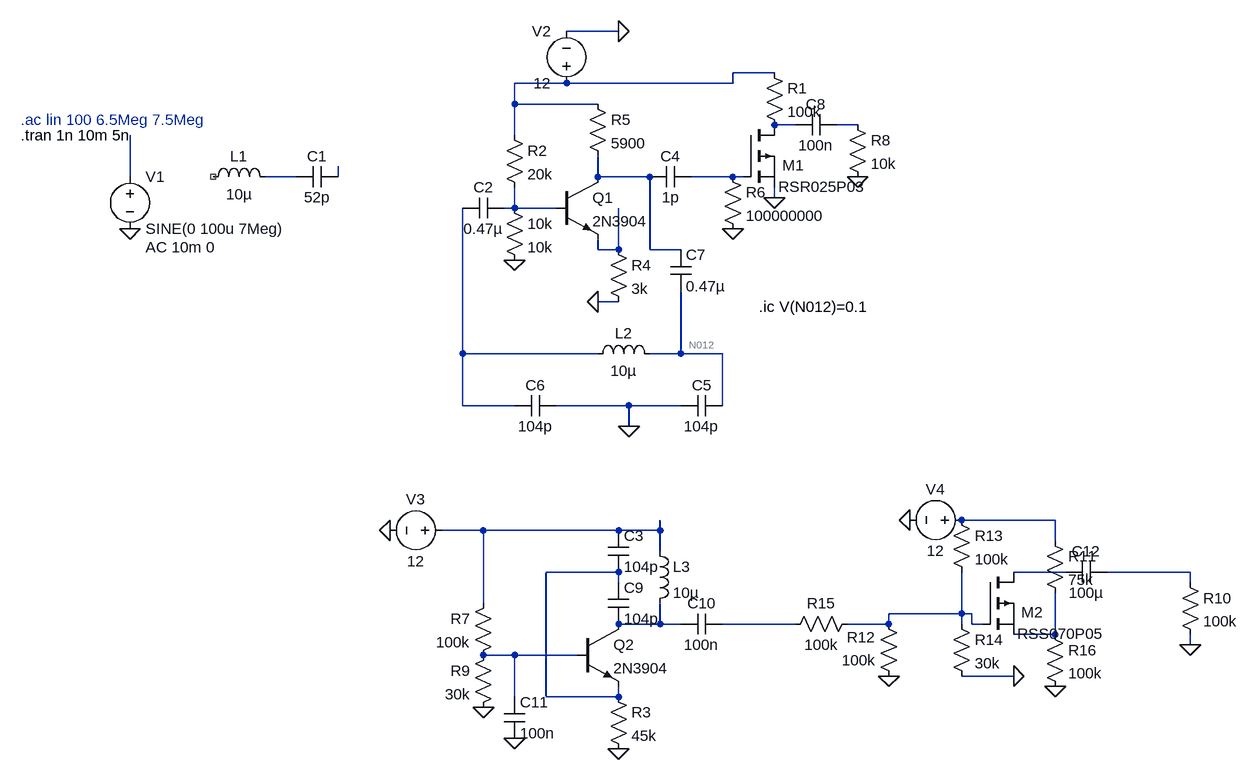
[diagram p0: schematic Colpitts.asc]
Colpitts.asc, the LTspice schematic file:
Version 4.1
SHEET 1 1552 1028
WIRE 528 -96 448 -96
WIRE 768 -32 704 -32
WIRE 448 -16 368 -16
WIRE 704 -16 704 -32
WIRE 704 -16 448 -16
WIRE 368 16 368 -16
WIRE 496 16 368 16
WIRE 800 48 768 48
WIRE 896 48 864 48
WIRE 368 64 368 16
WIRE -224 128 -224 64
WIRE 32 128 -16 128
WIRE 96 128 96 112
WIRE 496 128 496 96
WIRE 576 128 496 128
WIRE 704 128 640 128
WIRE 720 128 704 128
WIRE 768 160 768 144
WIRE 368 176 368 144
WIRE 368 176 352 176
WIRE 432 176 368 176
WIRE 496 240 496 224
WIRE 528 240 528 176
WIRE 528 240 496 240
WIRE 576 240 576 128
WIRE 624 240 576 240
WIRE 528 320 496 320
WIRE 288 400 288 176
WIRE 496 400 288 400
WIRE 624 400 624 304
WIRE 624 400 576 400
WIRE 688 400 624 400
WIRE 288 480 288 400
WIRE 368 480 288 480
WIRE 544 480 432 480
WIRE 624 480 544 480
WIRE 688 480 688 400
WIRE 544 512 544 480
WIRE 1200 656 1056 656
WIRE 320 672 256 672
WIRE 528 672 320 672
WIRE 592 672 592 656
WIRE 592 672 528 672
WIRE 1200 688 1200 656
WIRE 592 704 592 672
WIRE 528 736 416 736
WIRE 1216 736 1136 736
WIRE 1408 736 1280 736
WIRE 528 752 528 736
WIRE 1408 752 1408 736
WIRE 320 784 320 672
WIRE 1056 800 1056 736
WIRE 1056 800 944 800
WIRE 1072 800 1056 800
WIRE 592 816 592 784
WIRE 592 816 528 816
WIRE 624 816 592 816
WIRE 800 816 688 816
WIRE 944 816 944 800
WIRE 944 816 880 816
WIRE 1056 816 1056 800
WIRE 1072 816 1072 800
WIRE 1088 816 1072 816
WIRE 1200 832 1200 768
WIRE 1200 832 1136 832
WIRE 1408 848 1408 832
WIRE 368 864 320 864
WIRE 464 864 368 864
WIRE 1136 896 1056 896
WIRE 368 928 368 864
WIRE 416 928 416 736
WIRE 528 928 528 912
WIRE 528 928 416 928
FLAG -224 208 0
FLAG 368 256 0
FLAG 496 320 0
FLAG 528 -96 0
FLAG 544 512 0
FLAG 704 208 0
FLAG 896 128 0
FLAG 768 160 0
FLAG 320 944 0
FLAG 528 1008 0
FLAG 176 672 0
FLAG 368 992 0
FLAG 976 656 0
FLAG 1136 896 0
FLAG 1408 848 0
FLAG 944 896 0
FLAG 1200 912 0
SYMBOL ind -112 144 R270
WINDOW 0 32 56 VTop 2
WINDOW 3 5 56 VBottom 2
SYMATTR InstName L1
SYMATTR Value 10µ
SYMATTR SpiceLine Rser=1m
SYMBOL cap 96 112 R90
WINDOW 0 0 32 VBottom 2
WINDOW 3 32 32 VTop 2
SYMATTR InstName C1
SYMATTR Value 52p
SYMBOL voltage -224 112 R0
WINDOW 123 24 124 Left 2
WINDOW 39 0 0 Left 0
SYMATTR Value2 AC 10m 0
SYMATTR InstName V1
SYMATTR Value SINE(0 100u 7Meg)
SYMBOL npn 432 128 R0
SYMATTR InstName Q1
SYMATTR Value 2N3904
SYMBOL res 352 48 R0
SYMATTR InstName R2
SYMATTR Value 20k
SYMBOL res 352 160 R0
SYMATTR InstName 10k
SYMATTR Value 10k
SYMBOL res 480 0 R0
SYMATTR InstName R5
SYMATTR Value 5900
SYMBOL voltage 448 0 R180
WINDOW 0 24 96 Left 2
WINDOW 3 24 16 Left 2
WINDOW 123 0 0 Left 0
WINDOW 39 0 0 Left 0
SYMATTR InstName V2
SYMATTR Value 12
SYMBOL cap 352 160 R90
WINDOW 0 0 32 VBottom 2
WINDOW 3 32 32 VTop 2
SYMATTR InstName C2
SYMATTR Value 0.47µ
SYMBOL res 512 224 R0
SYMATTR InstName R4
SYMATTR Value 3k
SYMBOL ind 480 416 R270
WINDOW 0 32 56 VTop 2
WINDOW 3 5 56 VBottom 2
SYMATTR InstName L2
SYMATTR Value 10µ
SYMATTR SpiceLine Rser=1m
SYMBOL cap 688 464 R90
WINDOW 0 0 32 VBottom 2
WINDOW 3 32 32 VTop 2
SYMATTR InstName C5
SYMATTR Value 104p
SYMBOL cap 432 464 R90
WINDOW 0 0 32 VBottom 2
WINDOW 3 32 32 VTop 2
SYMATTR InstName C6
SYMATTR Value 104p
SYMBOL pmos 720 48 R0
WINDOW 0 60 62 Left 2
WINDOW 3 54 95 Left 2
SYMATTR InstName M1
SYMATTR Value RSR025P03
SYMBOL res 688 112 R0
SYMATTR InstName R6
SYMATTR Value 100000000
SYMBOL cap 608 240 R0
SYMATTR InstName C7
SYMATTR Value 0.47µ
SYMBOL cap 640 112 R90
WINDOW 0 0 32 VBottom 2
WINDOW 3 32 32 VTop 2
SYMATTR InstName C4
SYMATTR Value 1p
SYMBOL res 752 -48 R0
SYMATTR InstName R1
SYMATTR Value 100k
SYMBOL cap 864 32 R90
WINDOW 0 0 32 VBottom 2
WINDOW 3 32 32 VTop 2
SYMATTR InstName C8
SYMATTR Value 100n
SYMBOL res 880 32 R0
SYMATTR InstName R8
SYMATTR Value 10k
SYMBOL npn 464 816 R0
SYMATTR InstName Q2
SYMATTR Value 2N3904
SYMBOL res 512 912 R0
SYMATTR InstName R3
SYMATTR Value 45k
SYMBOL cap 512 672 R0
SYMATTR InstName C3
SYMATTR Value 104p
SYMBOL cap 512 752 R0
SYMATTR InstName C9
SYMATTR Value 104p
SYMBOL res 336 768 M0
SYMATTR InstName R7
SYMATTR Value 100k
SYMBOL res 336 848 M0
SYMATTR InstName R9
SYMATTR Value 30k
SYMBOL voltage 272 672 R90
WINDOW 0 -32 56 VBottom 2
WINDOW 3 32 56 VTop 2
WINDOW 123 0 0 Left 0
WINDOW 39 0 0 Left 0
SYMATTR InstName V3
SYMATTR Value 12
SYMBOL cap 688 800 R90
WINDOW 0 0 32 VBottom 2
WINDOW 3 32 32 VTop 2
SYMATTR InstName C10
SYMATTR Value 100n
SYMBOL ind 576 688 R0
SYMATTR InstName L3
SYMATTR Value 10µ
SYMATTR SpiceLine Rser=1m
SYMBOL cap 352 928 R0
SYMATTR InstName C11
SYMATTR Value 100n
SYMBOL cap 1280 720 R90
WINDOW 0 0 32 VBottom 2
WINDOW 3 32 32 VTop 2
SYMATTR InstName C12
SYMATTR Value 100µ
SYMBOL pmos 1088 736 R0
WINDOW 0 60 62 Left 2
WINDOW 3 54 95 Left 2
SYMATTR InstName M2
SYMATTR Value RSS070P05
SYMBOL voltage 1072 656 R90
WINDOW 0 -32 56 VBottom 2
WINDOW 3 32 56 VTop 2
WINDOW 123 0 0 Left 0
WINDOW 39 0 0 Left 0
SYMATTR InstName V4
SYMATTR Value 12
SYMBOL res 1040 640 R0
SYMATTR InstName R13
SYMATTR Value 100k
SYMBOL res 1040 800 R0
SYMATTR InstName R14
SYMATTR Value 30k
SYMBOL res 1184 672 R0
SYMATTR InstName R11
SYMATTR Value 75k
SYMBOL res 1392 736 R0
SYMATTR InstName R10
SYMATTR Value 100k
SYMBOL res 896 800 R90
WINDOW 0 0 56 VBottom 2
WINDOW 3 32 56 VTop 2
SYMATTR InstName R15
SYMATTR Value 100k
SYMBOL res 960 912 R180
WINDOW 0 36 76 Left 2
WINDOW 3 36 40 Left 2
SYMATTR InstName R12
SYMATTR Value 100k
SYMBOL res 1184 816 R0
SYMATTR InstName R16
SYMATTR Value 100k
TEXT -392 64 Left 2 !.tran 1n 10m 5n
TEXT -392 40 Left 2 ;.ac lin 100 6.5Meg 7.5Meg
TEXT 744 328 Left 2 !.ic V(N012)=0.1

The netlist it stands for:
* Colpitts.asc
L1 NC_01 N005 10µ Rser=1m
C1 N006 N005 52p
V1 N004 0 SINE(0 100u 7Meg) AC 10m 0
Q1 N007 N009 N010 0 2N3904
R2 N001 N009 20k
R§10k N009 0 10k
R5 N001 N007 5900
V2 N001 0 12
C2 N009 N011 0.47µ
R4 N010 0 3k
L2 N011 N012 10µ Rser=1m
C5 N012 0 104p
C6 0 N011 104p
M1 N002 N008 0 0 RSR025P03
R6 N008 0 100000000
C7 N007 N012 0.47µ
C4 N008 N007 1p
R1 N001 N002 100k
C8 N003 N002 100n
R8 N003 0 10k
Q2 N019 N022 N015 0 2N3904
R3 N015 0 45k
C3 N014 N015 104p
C9 N015 N019 104p
R7 N014 N022 100k
R9 N022 0 30k
V3 N014 0 12
C10 N020 N019 100n
L3 N014 N019 10µ Rser=1m
C11 N022 0 100n
C12 N017 N016 100µ
M2 N016 N018 N021 N021 RSS070P05
V4 N013 0 12
R13 N013 N018 100k
R14 N018 0 30k
R11 N013 N021 75k
R10 N017 0 100k
R15 N018 N020 100k
R12 0 N018 100k
R16 N021 0 100k
.model NPN NPN
.model PNP PNP
.lib standard.bjt
.model NMOS NMOS
.model PMOS PMOS
.lib standard.mos
.tran 1n 10m 5n
* .ac lin 100 6.5Meg 7.5Meg
.ic V(N012)=0.1
.backanno
.end